# EAGLE design Sonar-Three-Amp-Block (EAGLE 8.7.1)
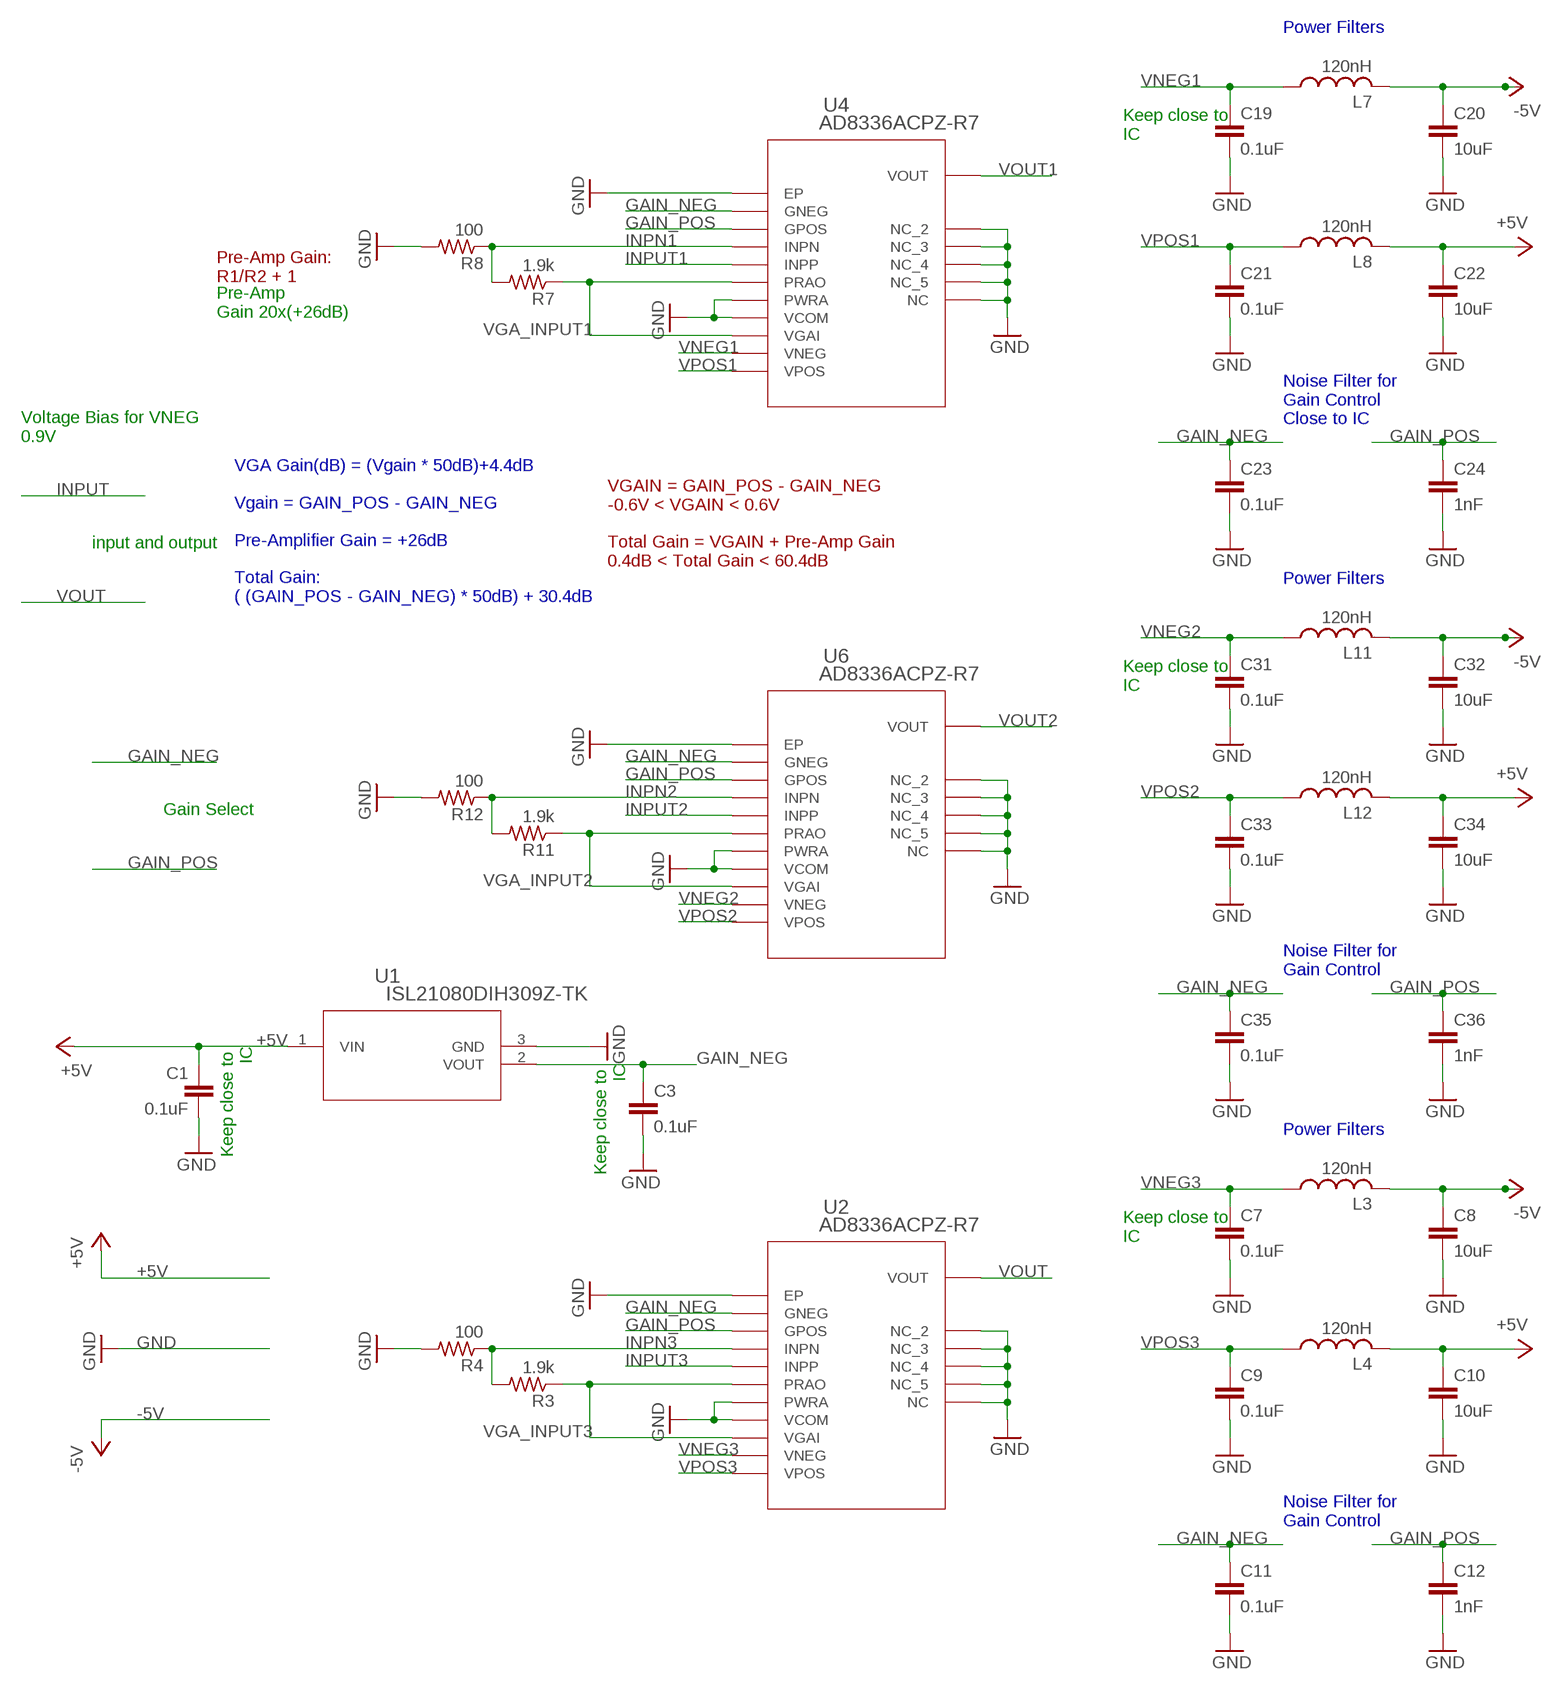
[diagram p0: schematic, sheet 1]

## Parts
C1  0.1uF  C-EUC0603  [C0603]
C3  0.1uF  C-EUC0603  [C0603]
C7  0.1uF  C-EUC0603  [C0603]
C8  10uF  C-EUC1206  [C1206]
C9  0.1uF  C-EUC0603  [C0603]
C10  10uF  C-EUC1206  [C1206]
C11  0.1uF  C-EUC0603  [C0603]
C12  1nF  C-EUC0603  [C0603]
C19  0.1uF  C-EUC0603  [C0603]
C20  10uF  C-EUC1206  [C1206]
C21  0.1uF  C-EUC0603  [C0603]
C22  10uF  C-EUC1206  [C1206]
C23  0.1uF  C-EUC0603  [C0603]
C24  1nF  C-EUC0603  [C0603]
C31  0.1uF  C-EUC0603  [C0603]
C32  10uF  C-EUC1206  [C1206]
C33  0.1uF  C-EUC0603  [C0603]
C34  10uF  C-EUC1206  [C1206]
C35  0.1uF  C-EUC0603  [C0603]
C36  1nF  C-EUC0603  [C0603]
L3  120nH  L-USL3225P  [L3225P]
L4  120nH  L-USL3225P  [L3225P]
L7  120nH  L-USL3225P  [L3225P]
L8  120nH  L-USL3225P  [L3225P]
L11  120nH  L-USL3225P  [L3225P]
L12  120nH  L-USL3225P  [L3225P]
R3  1.9k  R-US_R0603  [R0603]
R4  100  R-US_R0603  [R0603]
R7  1.9k  R-US_R0603  [R0603]
R8  100  R-US_R0603  [R0603]
R11  1.9k  R-US_R0603  [R0603]
R12  100  R-US_R0603  [R0603]
U1  ISL21080DIH309Z-TK  [P3_064]
U2  AD8336ACPZ-R7  [CP_16_4]
U4  AD8336ACPZ-R7  [CP_16_4]
U6  AD8336ACPZ-R7  [CP_16_4]

## Nets
+5V: C1.1 C10.1 C22.1 C34.1 L4.2 L8.2 L12.2 U1.1(VIN)
-5V: C8.1 C20.1 C32.1 L3.2 L7.2 L11.2
GAIN_NEG: C3.1 C11.1 C23.1 C35.1 U1.2(VOUT) U2.GNEG U4.GNEG U6.GNEG
GAIN_POS: C12.1 C24.1 C36.1 U2.GPOS U4.GPOS U6.GPOS
GND: C1.2 C3.2 C7.2 C8.2 C9.2 C10.2 C11.2 C12.2 C19.2 C20.2 C21.2 C22.2 C23.2 C24.2 C31.2 C32.2 C33.2 C34.2 C35.2 C36.2 R4.2 R8.2 R12.2 U1.3(GND) U2.GND1(EP) U2.NC U2.NC1(NC_2) U2.NC2(NC_3) U2.NC3(NC_4) U2.NC4(NC_5) U2.PWRA U2.VCOM U4.GND1(EP) U4.NC U4.NC1(NC_2) U4.NC2(NC_3) U4.NC3(NC_4) U4.NC4(NC_5) U4.PWRA U4.VCOM U6.GND1(EP) U6.NC U6.NC1(NC_2) U6.NC2(NC_3) U6.NC3(NC_4) U6.NC4(NC_5) U6.PWRA U6.VCOM
INPN1: R7.2 R8.1 U4.INPN
INPN2: R11.2 R12.1 U6.INPN
INPN3: R3.2 R4.1 U2.INPN
INPUT1: U4.INPP
INPUT2: U6.INPP
INPUT3: U2.INPP
VGA_INPUT1: R7.1 U4.PRAO U4.VGAI
VGA_INPUT2: R11.1 U6.PRAO U6.VGAI
VGA_INPUT3: R3.1 U2.PRAO U2.VGAI
VNEG1: C19.1 L7.1 U4.VNEG
VNEG2: C31.1 L11.1 U6.VNEG
VNEG3: C7.1 L3.1 U2.VNEG
VOUT: U2.VOUT
VOUT1: U4.VOUT
VOUT2: U6.VOUT
VPOS1: C21.1 L8.1 U4.VPOS
VPOS2: C33.1 L12.1 U6.VPOS
VPOS3: C9.1 L4.1 U2.VPOS

## Notes on the sheet
- Power Filters
- Keep close to 
  IC
- Pre-Amp Gain:
  R1/R2 + 1
- Pre-Amp 
  Gain 20x(+26dB)
- Noise Filter for
  Gain Control
  Close to IC
- Voltage Bias for VNEG
  0.9V
- input and output
- VGAIN = GAIN_POS - GAIN_NEG
  -0.6V < VGAIN < 0.6V
  
  Total Gain = VGAIN + Pre-Amp Gain
  0.4dB < Total Gain < 60.4dB
- Power Filters
- VGA Gain(dB) = (Vgain * 50dB)+4.4dB
  
  Vgain = GAIN_POS - GAIN_NEG
  
  Pre-Amplifier Gain = +26dB
  
  Total Gain:
  ( (GAIN_POS - GAIN_NEG) * 50dB) + 30.4dB
- Keep close to 
  IC
- Gain Select
- Noise Filter for
  Gain Control
- Keep close to 
  IC
- Keep close to 
  IC
- Power Filters
- Keep close to 
  IC
- Noise Filter for
  Gain Control

## Library data of the parts
C1 C3 C7 C9 C11 C12 C19 C21 C23 C24 C31 C33 C35 C36 = rcl:C-EU: CAPACITOR, European symbol; SPICEPREFIX: C
C8 C10 C20 C22 C32 C34 = resistor:C-EU: CAPACITOR, European symbol
L3 L4 L7 L8 L11 L12 = resistor:L-US: INDUCTOR, American symbol
R3 R4 R7 R8 R11 R12 = rcl:R-US_: RESISTOR, American symbol; SPICEPREFIX: R
U1 = Amplifier-Sonar-Prototype-LBR:ISL21080DIH309Z-TK; MANUFACTURER_PART_NUMBER: ISL21080DIH309ZTK; VENDOR: Intersil
U2 U4 U6 = Amplifier-Sonar-LBR:AD8336ACPZ-R7; MANUFACTURER_PART_NUMBER: AD8336ACPZR7; VENDOR: Analog Devices Inc

## Board
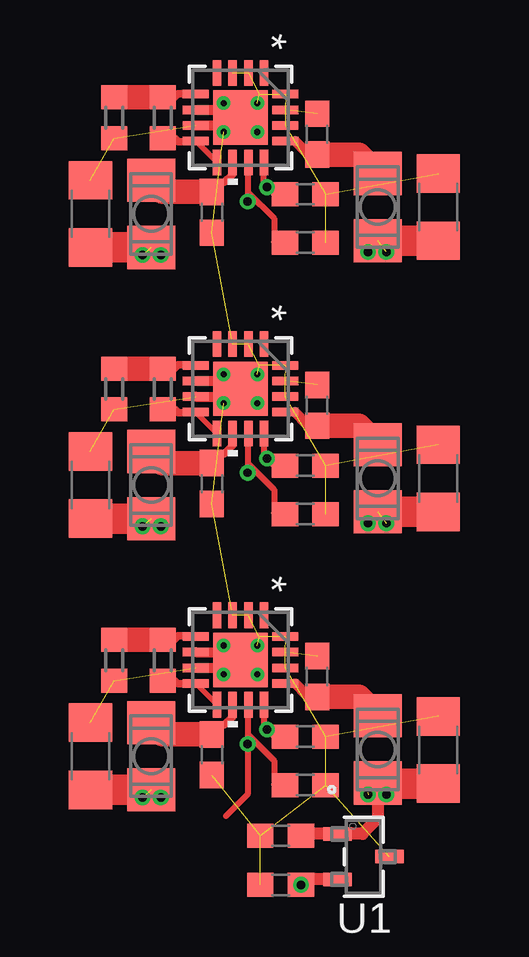
[diagram p1: board, top side]
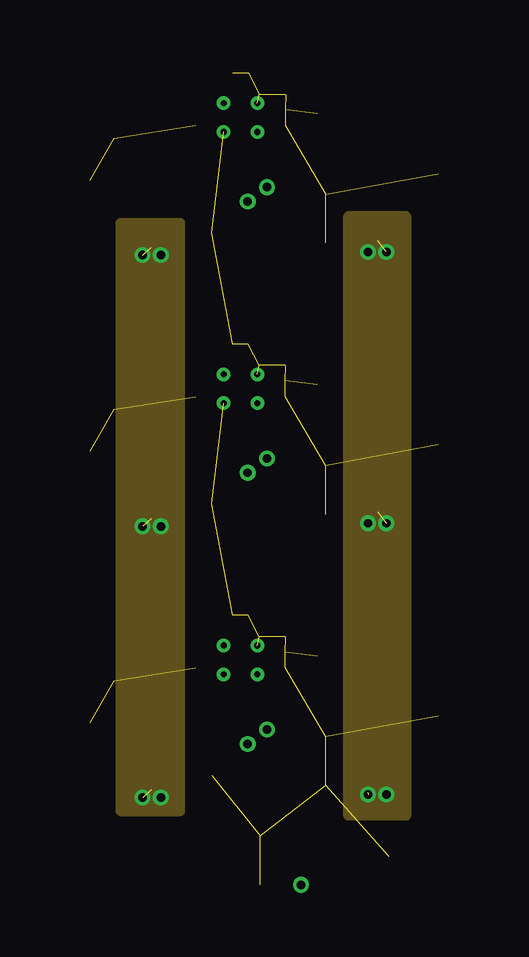
[diagram p2: board, inner layer Route15]
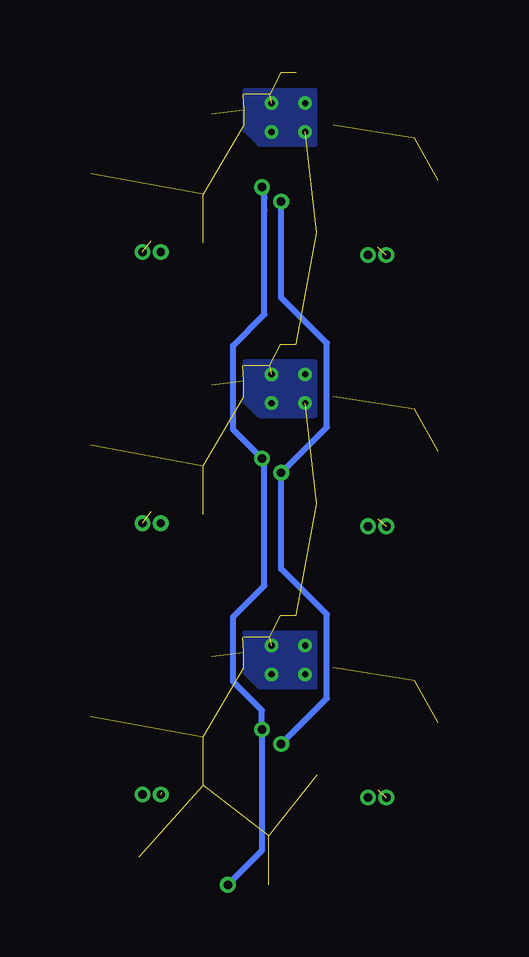
[diagram p3: board, bottom side, seen from below]

No outline drawn. Coordinates in mm, seen from the top.
Copper layers (1*2*15*16): Top 0.035mm / dielectric 0.1702mm / Route2 0.0175mm / dielectric 47mil / Route15 0.0175mm / dielectric 0.1702mm / Bottom 0.035mm
Design rules "JLCPCB4Layer": minimum track width 6mil, minimum drill 10mil, track to track 6mil, track to pad 6mil, pad to pad 6mil, via to via 6mil, smd to smd 0mil, copper to edge 10mil, drill to drill 10mil, minimum pad ring 6mil, minimum via ring 6mil, stop-mask expansion 2mil, vias tented up to drill 100mil, thermal gap 10mil

### Footprints (pad centres in the part's own frame; a part is rotated, then mirrored left to right if it is on the bottom)
C0603 = smd 1.1 x 1: 1 -0.85,0; 2 0.85,0
C1206 = smd 1.6 x 1.8: 1 -1.4,0; 2 1.4,0
L3225P = smd 1.8 x 2: 1 -1.4,0; 2 1.4,0
R0603 = smd 1 x 1.1: 1 -0.85,0; 2 0.85,0
P3_064 = smd 0.559 x 1.194: 1 -0.95,-1.079; 2 0.95,-1.079; 3 0,1.079
CP_16_4 = smd 2.261 x 2.261: GND1 0,0 | smd 1.067 x 0.356: GNEG 1.865,0.975; GPOS 1.865,0.325; INPP -1.865,-0.975; PWRA -1.865,0.325; VCOM -1.865,-0.325; VGAI 1.865,-0.975; VNEG 1.865,-0.325; VOUT -1.865,0.975 | smd 0.356 x 1.067: INPN -0.975,-1.865; NC 0.325,-1.865; NC1 -0.325,-1.865; NC2 0.325,1.865; NC3 -0.325,1.865; NC4 -0.975,1.865; PRAO 0.975,-1.865; VPOS 0.975,1.865

### Placement (x,y rotation side)
C1  10.07,5.78 180 top
C3  10.07,3.73 180 top
C7  7.21,31.75 270 top
C8  2.15,31.69 90 top
C9  11.6,35.01 90 top
C10  16.64,31.97 90 top
C11  11.1,32.5 0 top
C12  11.1,30.48 0 top
C19  7.21,9.15 270 top
C20  2.15,9.09 90 top
C21  11.6,12.41 90 top
C22  16.64,9.35 90 top
C23  11.1,9.9 0 top
C24  11.1,7.88 0 top
C31  7.21,20.45 270 top
C32  2.15,20.39 90 top
C33  11.6,23.71 90 top
C34  16.64,20.67 90 top
C35  11.1,21.2 0 top
C36  11.1,19.18 0 top
L3  4.68,31.69 270 top
L4  14.12,31.97 270 top
L7  4.68,9.09 270 top
L8  14.12,9.37 270 top
L11  4.68,20.39 270 top
L12  14.12,20.67 270 top
R3  5.16,35.69 90 top
R4  3.14,35.69 270 top
R7  5.16,13.09 90 top
R8  3.14,13.09 270 top
R11  5.16,24.39 90 top
R12  3.14,24.39 270 top
U1  13.53,4.91 270 top
U2  8.4,35.7 270 top
U4  8.4,13.1 270 top
U6  8.4,24.4 270 top

### Tracks (layer width: path | path; a pad name or v marks a point on that pad's centre or on a via)
+5V  (via drill 0.35)  (3 unrouted)
  Top 0.508: C1.1 11.12,5.86 U1.1 13.47,5.86 14.12,6.5 L8.2
  Top 1.016: L8.2 13.7,7.58
  Top 1.27: C10.1 L4.2 | C34.1 L12.2 | C22.1 14.14,7.95 L8.2
  other vias: 13.72,18.8 14.48,18.8 13.72,30.1 14.48,30.1 13.72,7.49 14.48,7.49
  pour Route15 (no thermals): 15.3,6.6 12.9,6.6 12.9,16.6 12.9,27.9 12.9,29.1 12.9,31.6 15.3,31.6
-5V  (via drill 0.35)  (3 unrouted)
  Top 1.27: L11.2 C32.1 | L7.2 C20.1 | L3.2 C8.1
  other vias: 5.08,7.37 4.32,7.37 5.08,29.97 4.32,29.97 5.08,18.67 4.32,18.67
  pour Route15 (no thermals): 5.9,31.3 3.4,31.3 3.4,6.8 5.9,6.8
GAIN_NEG  (via drill 0.35)
  Top 0.254: U2.GNEG 9.38,32.92 v9.5,32.8 9.8,32.5 C11.1 | U6.GNEG 9.38,21.62 v9.5,21.5 9.8,21.2 C35.1 | U4.GNEG 9.38,10.32 v9.5,10.2 9.8,9.9 C23.1
  Top 0.508: U1.2 11.27,3.96 C3.1
  Bottom 0.254: v9.5,32.8 9.4,32.7 9.4,32.36 9.41,32.35 9.41,31.85 9.4,31.84 9.4,27.5 10.7,26.2 10.7,22.7 v9.5,21.5 9.4,21.4 9.4,16.2 10.7,14.9 10.7,12.2 9.5,11 v9.5,10.2 9.5,5.16 C3.1
  other vias: 10.92,3.73
GAIN_POS  (via drill 0.35)
  Top 0.254: 8.72,9.97 U4.GPOS | C24.1 9.8,7.92 9.8,8.9 8.72,9.97 | 8.72,21.27 U6.GPOS | C36.1 9.8,19.22 9.8,20.2 8.82,21.18 | 8.72,21.27 8.82,21.18 | 8.72,32.58 U2.GPOS | C12.1 9.8,30.52 9.8,31.5 8.72,32.58 | 8.8,21.15 8.82,21.18 | 8.72,32.23 8.72,32.58 | 8.72,20.93 8.72,21.27 | 8.72,9.62 8.72,9.97 | v8.7,9.6 8.7,7.5 7.8,6.6
  Top 0.406: v8.7,32.2 8.72,32.23 | v8.7,20.9 8.72,20.93 | v8.7,9.6 8.72,9.62
  Bottom 0.254: v8.7,9.6 6.8,11.5 6.8,15 8.7,16.9 v8.7,20.9 6.8,22.8 6.8,26.3 8.7,28.2 v8.7,32.2
GND  (via drill 0.26)  (44 unrouted)
  Top 0.152: 8.07,13.43 8.3,13.2 | 8.3,13.2 U4.GND1 | 8.07,12.78 8.35,13.05 | 8.35,13.05 U4.GND1 | 8.07,13.32 8.35,13.05 | 9.18,14.07 8.3,13.2 | 8.72,13.43 8.45,13.15 | 8.82,12.78 8.45,13.15 | 8.45,13.15 U4.GND1 | 8.07,24.73 8.3,24.5 | 8.3,24.5 U6.GND1 | 8.07,24.07 8.35,24.35 | 8.35,24.35 U6.GND1 | 8.07,24.62 8.35,24.35 | 9.18,25.38 8.3,24.5 | 8.72,24.73 8.45,24.45 | 8.82,24.07 8.45,24.45 | 8.45,24.45 U6.GND1 | 8.07,36.02 8.3,35.8 | 8.3,35.8 U2.GND1 | 8.07,35.38 8.35,35.65 | 8.35,35.65 U2.GND1 | 8.07,35.92 8.35,35.65 | 9.18,36.67 8.3,35.8 | 8.72,36.02 8.45,35.75 | 8.82,35.38 8.45,35.75 | 8.45,35.75 U2.GND1
  Top 0.305: 10.29,14.05 U4.NC4 | 10.29,25.35 U6.NC4 | 10.29,36.65 U2.NC4
  Top 0.406: U4.NC1 8.07,13.43 | U4.NC 8.07,12.78 | U6.NC1 8.07,24.73 | U6.NC 8.07,24.07 | U2.NC1 8.07,36.02 | U2.NC 8.07,35.38
  other vias: 9.1,13.7 9.1,12.5 7.7,12.5 7.7,13.7 9.1,25 9.1,23.8 7.7,23.8 7.7,25 9.1,36.3 9.1,35.1 7.7,35.1 7.7,36.3
  pour Bottom (no thermals): 7.3,14.2 10.2,14.2 10.2,12.6 9.6,12 7.3,12
  pour Bottom (no thermals): 7.3,25.5 10.2,25.5 10.2,23.9 9.6,23.3 7.3,23.3
  pour Bottom (no thermals): 7.3,36.8 10.2,36.8 10.2,35.2 9.6,34.6 7.3,34.6
INPN1
  Top 0.305: R7.2 5.64,13.94 5.8,14.1 6.51,14.1 U4.INPN
  Top 1.016: R8.1 R7.2
INPN2
  Top 0.305: R11.2 5.64,25.24 5.8,25.4 6.51,25.4 U6.INPN
  Top 1.016: R12.1 R11.2
INPN3
  Top 0.305: R3.2 5.64,36.54 5.8,36.7 6.51,36.7 U2.INPN
  Top 1.016: R4.1 R3.2
VGA_INPUT1
  Top 0.2: U4.VGAI U4.PRAO
  Top 0.305: R7.1 5.66,12.24 5.8,12.1 6.51,12.1 U4.PRAO
VGA_INPUT2
  Top 0.2: U6.VGAI U6.PRAO
  Top 0.305: R11.1 5.66,23.54 5.8,23.4 6.51,23.4 U6.PRAO
VGA_INPUT3
  Top 0.2: U2.VGAI U2.PRAO
  Top 0.305: R3.1 5.66,34.84 5.8,34.7 6.51,34.7 U2.PRAO
VNEG1
  Top 0.254: U4.VNEG 8.07,10.74
  Top 0.305: C19.1 7.61,10.4 7.73,10.4 8.07,10.74
  Top 0.813: L7.1 5.17,10
  Top 1.016: 5.17,10 C19.1
VNEG2
  Top 0.254: U6.VNEG 8.07,22.04
  Top 0.305: C31.1 7.61,21.7 7.73,21.7 8.07,22.04
  Top 0.813: L11.1 5.17,21.3
  Top 1.016: 5.17,21.3 C31.1
VNEG3
  Top 0.254: U2.VNEG 8.07,33.34
  Top 0.305: C7.1 7.61,33 7.73,33 8.07,33.34
  Top 0.813: L3.1 5.17,32.6
  Top 1.016: 5.17,32.6 C7.1
VPOS1
  Top 0.254: U4.VPOS 10.68,12.12
  Top 0.406: C21.1 11.15,11.65 10.68,12.12
  Top 1.016: L8.1 13.33,11.56 C21.1
VPOS2
  Top 0.254: U6.VPOS 10.68,23.43
  Top 0.406: C33.1 11.15,22.95 10.68,23.43
  Top 1.016: L12.1 13.33,22.86 C33.1
VPOS3
  Top 0.254: U2.VPOS 10.68,34.73
  Top 0.406: C9.1 11.15,34.25 10.68,34.73
  Top 1.016: L4.1 13.33,34.16 C9.1